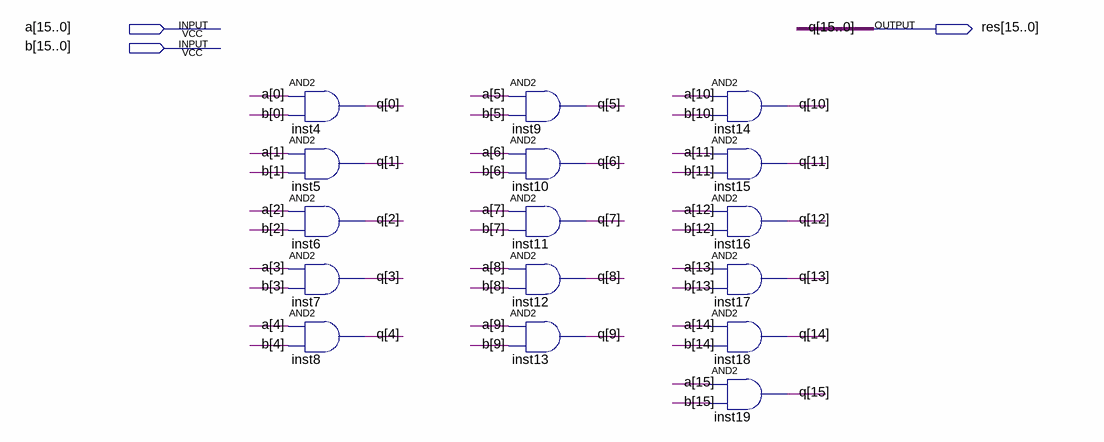
[diagram p0: schematic sheet]
// Quartus schematic myand.bdf as structural Verilog: 16 symbols, 3 pins
module myand (
  input  [15:0] a,
  input  [15:0] b,
  output [15:0] res
);

  and inst4 (res[0], a[0], b[0]);
  and inst5 (res[1], a[1], b[1]);
  and inst6 (res[2], a[2], b[2]);
  and inst7 (res[3], a[3], b[3]);
  and inst8 (res[4], a[4], b[4]);
  and inst9 (res[5], a[5], b[5]);
  and inst10 (res[6], a[6], b[6]);
  and inst11 (res[7], a[7], b[7]);
  and inst12 (res[8], a[8], b[8]);
  and inst13 (res[9], a[9], b[9]);
  and inst14 (res[10], a[10], b[10]);
  and inst15 (res[11], a[11], b[11]);
  and inst16 (res[12], a[12], b[12]);
  and inst17 (res[13], a[13], b[13]);
  and inst18 (res[14], a[14], b[14]);
  and inst19 (res[15], a[15], b[15]);

  // Other names for the same wires on the sheet: q[15:0] = res
endmodule
